# Altium schematic sheet TLV76701.SchDoc
size A4; SheetNumber: 9; SheetTotal: 16
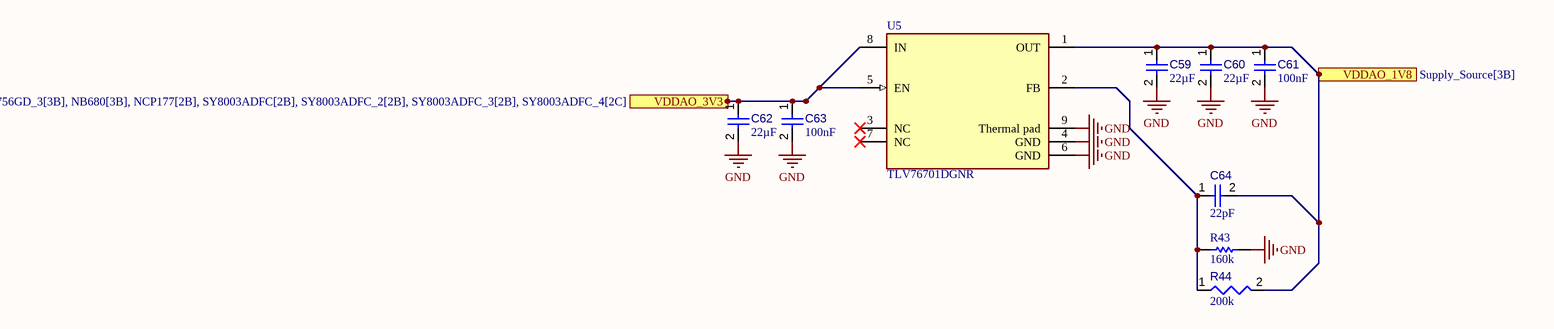
[diagram p0: TLV76701.SchDoc]

## Parts
C59  value 22µF  [CAPC0805(2012)145_L]  (hidden comment: Capacitor 22µF +/-40% 16V 0805)
C60  value 22µF  [CAPC0805(2012)145_L]  (hidden comment: Capacitor 22µF +/-40% 16V 0805)
C61  value 100nF  [CAPC0402(1005)60_L]  (hidden comment: Capacitor 100nF +/-20% 25V 0402)
C62  value 22µF  [CAPC0805(2012)145_L]  (hidden comment: Capacitor 22µF +/-40% 16V 0805)
C63  value 100nF  [CAPC0402(1005)60_L]  (hidden comment: Capacitor 100nF +/-20% 25V 0402)
C64  value 22pF  [CAPC0402(1005)60_L]  (hidden comment: Capacitor 22pF +/-10% 50V 0402)
R43  value 160k  [RESC0603X28X15ML05T05]  (hidden comment: CRCW0201160KFNED)
R44  value 200k  [RESC0402(1005)_L]  (hidden comment: Resistor 200K +/-1 % 0402 63 mW)
U5  TLV76701DGNR  [FP-DGN0008G-MFG]

## Ports
VDDAO_1V8 (see Supply_Source[3B]), VDDAO_3V3 (see Supply_Source[3B], MP8756GD_3[3B], NB680[3B], NCP177[2B], SY8003ADFC[2B], SY8003ADFC_2[2B], SY8003ADFC_3[2B], SY8003ADFC_4[2C])

## Nets
GND: C59.2 C60.2 C61.2 C62.2 C63.2 R43.2 U5.4(GND) U5.6(GND) U5.9(Thermal_pad)
VDDAO_1V8: C59.1 C60.1 C61.1 C64.2 R44.2 U5.1(OUT) ; port VDDAO_1V8
VDDAO_3V3: C62.1 C63.1 U5.5(EN) U5.8(IN) ; port VDDAO_3V3
NetC64_1: C64.1 R43.1 R44.1 U5.2(FB)

Not connected (* = marked no-connect by the designer): U5 3(NC)* 7(NC)*

## Library data of the parts
C59 C60 C62 = CMP-001-00081-4: Chip Capacitor, 22µF +/-40%, 16V, 0805, Thickness 1.45 mm; Tolerance: 5%; Voltage Rating: 16V; Mounting Technology: SMT; Pins: 2; Max Operating Temperature: 85°C; Case/Package: 0805; Min Operating Temperature: -55°C
C61 C63 = CMP-001-00065-4: Chip Capacitor, 100nF +/-20%, 25V, 0402, Thickness 0.6 mm; Tolerance: 10%; Max Operating Temperature: 85°C; Min Operating Temperature: -55°C; Pins: 2; Voltage Rating: 25V; Mounting Technology: SMT; Case/Package: 0402
C64 = CMP-001-00073-3: Chip Capacitor, 22pF +/-10%, 50V, 0402, Thickness 0.6 mm; Tolerance: 10%; Pins: 2; Voltage Rating: 50V; Max Operating Temperature: 85°C; Min Operating Temperature: -55°C; Mounting Technology: SMT; Case/Package: 0402
R43 = CMP-009-00222-1: CRCW Series 0201 160 kOhm ±1% 0.05 W ±200 ppm/K Thick Film Chip Resistor; Voltage Rating: 30V; Case/Package: 0201; Tolerance: 1%; Max Operating Temperature: 155°C; Mounting Technology: Surface Mount; Min Operating Temperature: -55°C
R44 = CMP-009-00163-3: Chip Resistor, 200 kOhms, +/-1 %, 63 mW, -55 to 155 degC, 0402; Power: 63mW; Tolerance: 1%; Min Operating Temperature: -55°C; Max Operating Temperature: 155°C; Case/Package: 0402; Pins: 2
U5 = CMP-00370-110083557-1: TLV76701DGNR Adjustable- and fixed-output, 1-A, 16-V, positive-voltage low-dropout (LDO) linear regulator 8-HVSSOP -40 to 125; Manufacturer Lifecycle Status: ACTIVE; Dropout Voltage: 900mV; Accuracy: 0.5%; Nominal Supply Current: 1.5mA; Output Current: 1A; Number of Outputs: 1; Min Supply Voltage: 2.5V; Max Junction Temperature (Tj): 125°C; Max Supply Voltage: 16V; Length: 3mm; Max Operating Temperature: 125°C; Width: 3mm; Lifecycle Status: Production; Thickness: 1.02mm; Height: 1.1mm; Min Operating Temperature: -40°C; Number of Pins: 8; Number of Channels: 1; NexarPartId: 110083557